# EAGLE design cdcio (EAGLE 6.6.0)
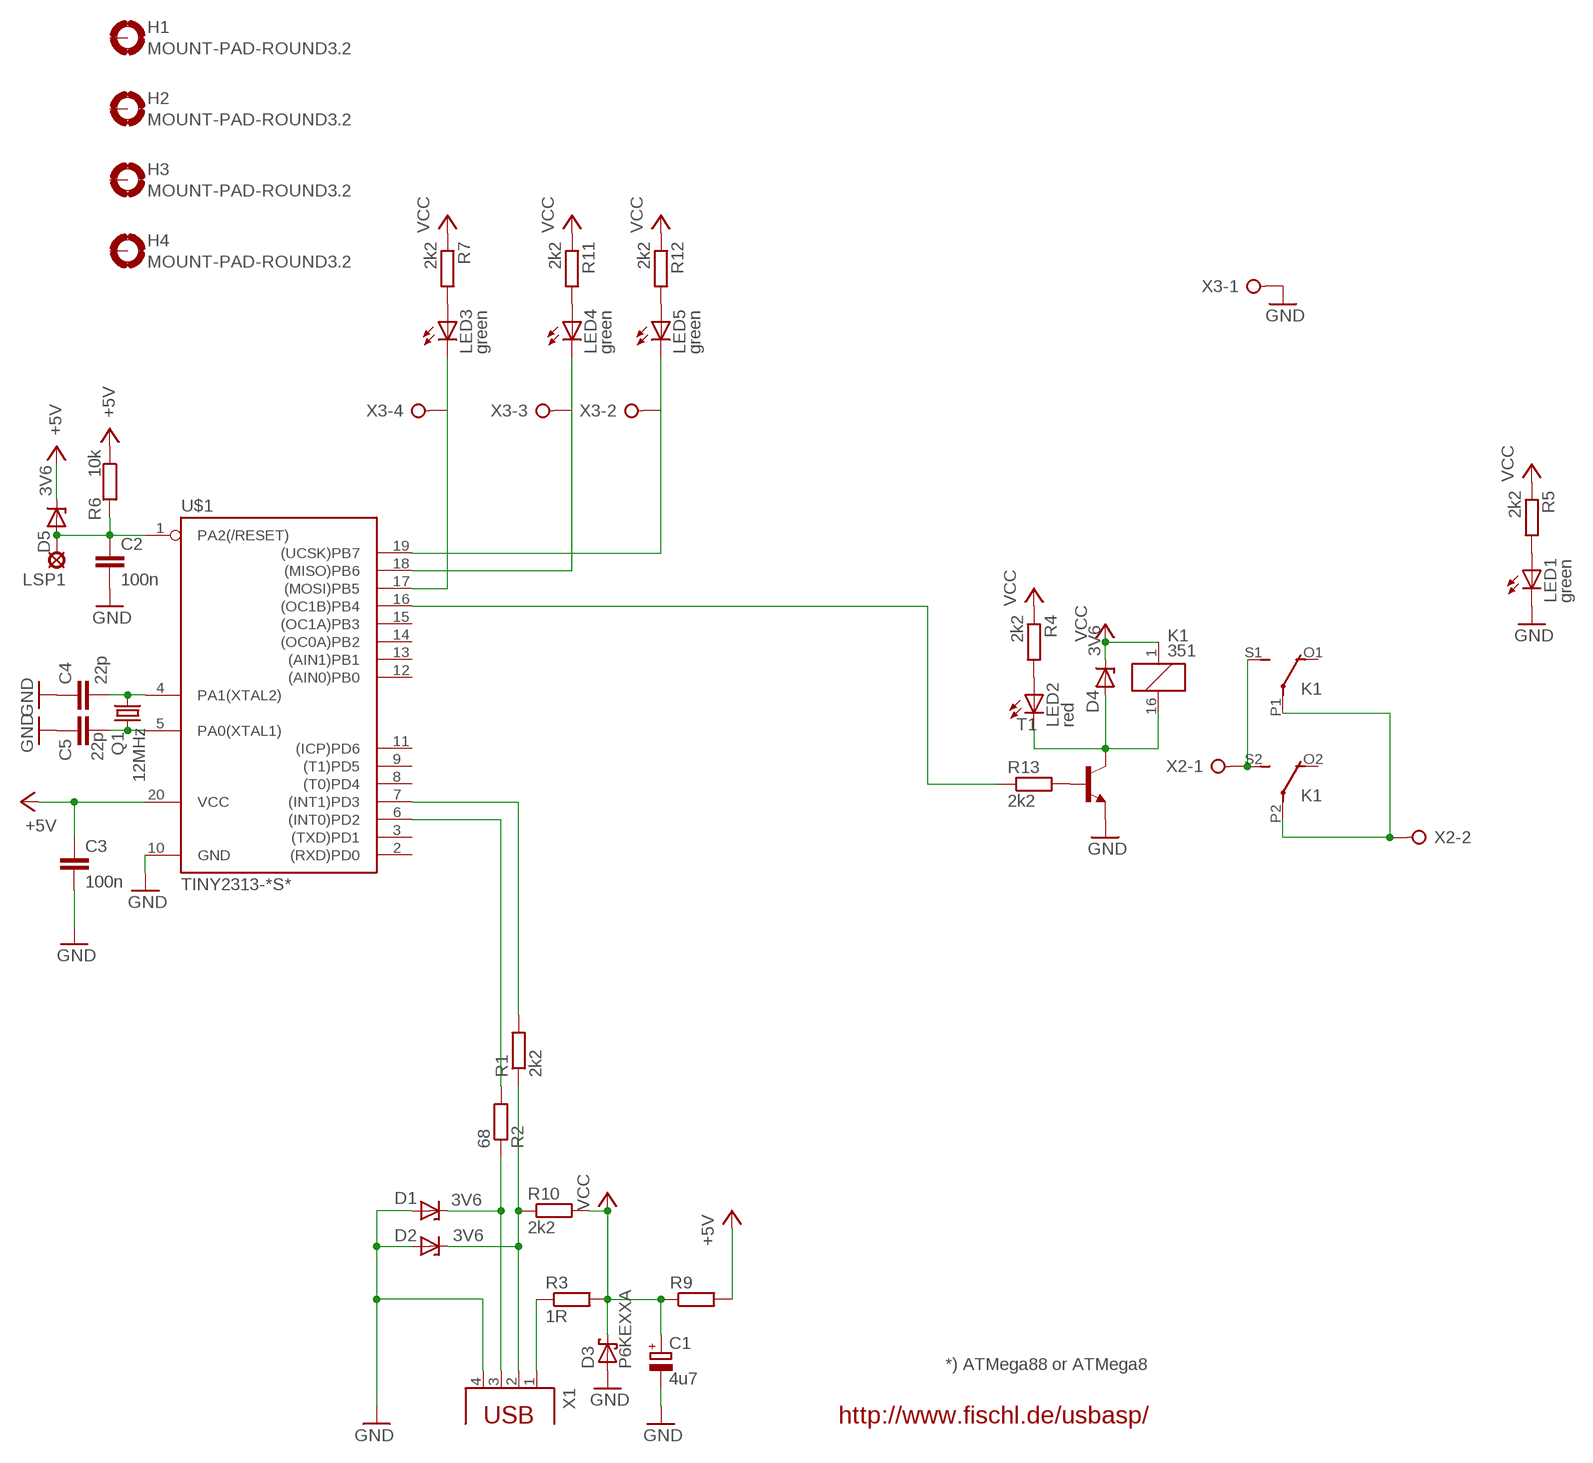
[diagram p0: schematic, sheet 1]

## Parts
C1  4u7  CPOL-EUE2.5-5  [E2,5-5]
C2  100n  C-EU025-024X044  [C025-024X044]
C3  100n  C-EU025-024X044  [C025-024X044]
C4  22p  C-EU025-024X044  [C025-024X044]
C5  22p  C-EU025-024X044  [C025-024X044]
D1  3V6  ZENER-DIODEDO34-7  [DO34Z7]
D2  3V6  ZENER-DIODEDO34-7  [DO34Z7]
D3  P6KEXXA  [C1702-15]
D4  3V6  ZENER-DIODEDO34-7  [DO34Z7]
D5  3V6  ZENER-DIODEDO34-7  [DO34Z7]
H1  MOUNT-PAD-ROUND3.2  [3,2-PAD]
H2  MOUNT-PAD-ROUND3.2  [3,2-PAD]
H3  MOUNT-PAD-ROUND3.2  [3,2-PAD]
H4  MOUNT-PAD-ROUND3.2  [3,2-PAD]
K1  351  [351]
LED1  green  LED3MM  [LED3MM]
LED2  red  LED3MM  [LED3MM]
LED3  green  LED3MM  [LED3MM]
LED4  green  LED3MM  [LED3MM]
LED5  green  LED3MM  [LED3MM]
LSP1  LSP10  [LSP10]
Q1  12MHz  CRYTALHC49S  [HC49/S]
R1  2k2  R-EU_0207/2V  [0207/2V]
R2  68  R-EU_0207/10  [0207/10]
R3  1R  R-EU_0207/2V  [0207/2V]
R4  2k2  R-EU_0207/2V  [0207/2V]
R5  2k2  R-EU_0207/2V  [0207/2V]
R6  10k  R-EU_0207/10  [0207/10]
R7  2k2  R-EU_0207/2V  [0207/2V]
R9  R-EU_0207/2V  [0207/2V]
R10  2k2  R-EU_0207/2V  [0207/2V]
R11  2k2  R-EU_0207/2V  [0207/2V]
R12  2k2  R-EU_0207/2V  [0207/2V]
R13  2k2  R-EU_0207/2V  [0207/2V]
T1  2N4124-NPN-TO92-CBE  [TO92-CBE]
U$1  TINY2313-*S*  [SO20L$]
X1  PN61729  [PN61729]
X2  W237-02P  [W237-132]
X3  W237-04P  [W237-4P]

## Nets
+5V: C3.1 D5.C R6.1 R9.2 U$1.20(VCC)
GND: C1.- C2.2 C3.2 C4.1 C5.1 D1.A D2.A D3.A LED1.K(C) T1.E U$1.10(GND) X1.4 X3.1
N$1: C2.1 D5.A LSP1.MP R6.2 U$1.1(PA2(/RESET))
N$2: R13.2 T1.B
N$3: R13.1 U$1.16((OC1B)PB4)
N$4: D4.A K1.16 LED2.K(C) T1.C
N$5: D2.C R1.1 R10.1 X1.2
N$6: K1.S1(2:S) K1.S2(3:S) X2.1
N$7: R2.2 U$1.6((INT0)PD2)
N$8: D1.C R2.1 X1.3
N$9: LED2.A R4.2
N$10: K1.P1(2:P) K1.P2(3:P) X2.2
N$11: R3.1 X1.1
N$12: LED1.A R5.2
N$13: LED3.A R7.2
N$14: LED4.A R11.2
N$15: LED5.A R12.2
N$16: R1.2 U$1.7((INT1)PD3)
N$17: LED3.K(C) U$1.17((MOSI)PB5) X3.4
N$18: LED4.K(C) U$1.18((MISO)PB6) X3.3
N$19: LED5.K(C) U$1.19((UCSK)PB7) X3.2
N$22: C4.2 Q1.2 U$1.4(PA1(XTAL2))
N$23: C5.2 Q1.1 U$1.5(PA0(XTAL1))
VCC: C1.+ D3.C D4.C K1.1 R3.2 R4.1 R5.1 R7.1 R9.1 R10.2 R11.1 R12.1
Unconnected: H1.B3,2(MOUNT) H2.B3,2(MOUNT) H3.B3,2(MOUNT) H4.B3,2(MOUNT) K1.O1(2:O) K1.O2(3:O) U$1.2((RXD)PD0) U$1.3((TXD)PD1) U$1.8((T0)PD4) U$1.9((T1)PD5) U$1.11((ICP)PD6) U$1.12((AIN0)PB0) U$1.13((AIN1)PB1) U$1.14((OC0A)PB2) U$1.15((OC1A)PB3)

## Notes on the sheet
- *) ATMega88 or ATMega8
- http://www.fischl.de/usbasp/

## Library data of the parts
C1 = rcl:CPOL-EU: POLARIZED CAPACITOR, European symbol
C2-C5 = rcl:C-EU: CAPACITOR, European symbol
D1 D2 D4 D5 = diode:ZENER-DIODE: Z-Diode
D3 = diode:P6KEXXA: DIODE transient-voltage suppressor
H1-H4 = holes:MOUNT-PAD-ROUND: MOUNTING PAD, round
K1 = relay:351: RELAY 2 x switch, Omron; OC_FARNELL: unknown; OC_NEWARK: unknown
LED1-LED5 = led:LED: LED OSRAM: - CHIPLED LG R971, LG N971, LY N971, LG Q971, LY Q971, LO R971, LY R971 LH N974, LH R974 LS Q976, LO Q976, LY Q976 LO Q996 - Hyper CHIPLED LW Q18S LB Q993, LB Q99A, LB R99A - SideLED LS A670, LO A670, LY A670, LG A670, LP A670 LB A673, LV A673, LT A673, LW A673 LH A674 LY A675 LS A676, LA A676, LO A676, LY A676, LW A676 LS A679, LY A679, LG A679 - Hyper Micro SIDELED® LS Y876, LA Y876, LO Y876, LY Y876 LT Y87S - SmartLED LW L88C, LW L88S LB L89C, LB L89S, LG L890 LS L89K, LO L89K, LY L89K LS L896, LA L896, LO L896, LY L896 - TOPLED LS T670, LO T670, LY T670, LG T670, LP T670 LSG T670, LSP T670, LSY T670, LOP T670, LYG T670 LG T671, LOG T671, LSG T671 LB T673, LV T673, LT T673, LW T673 LH T674 LS T676, LA T676, LO T676, LY T676, LB T676, LH T676, LSB T676, LW T676 LB T67C, LV T67C, LT T67C, LS T67K, LO T67K, LY T67K, LW E67C LS E67B, LA E67B, LO E67B, LY E67B, LB E67C, LV E67C, LT E67C LW T67C LS T679, LY T679, LG T679 LS T770, LO T770, LY T770, LG T770, LP T770 LB T773, LV T773, LT T773, LW T773 LH T774 LS E675, LA E675, LY E675, LS T675 LS T776, LA T776, LO T776, LY T776, LB T776 LHGB T686 LT T68C, LB T68C - Hyper Mini TOPLED® LB M676 - Mini TOPLED Santana® LG M470 LS M47K, LO M47K, LY M47K Source: http://www.osram.convergy.de/
LSP1 = solpad:LSP10: SOLDER PAD drill 1.0 mm, distributor Buerklin, 12H555
Q1 = crystal:CRYTAL: CRYSTAL
R1-R7 R9-R13 = rcl:R-EU_: RESISTOR, European symbol
T1 = transistor:*-NPN-: NPN Transistror BF959 corrected 2008.03.06
U$1 = avr-7:TINY2313*: Atmel Tiny2313 2K Flash, 128 bytes EEPROM, 128 bytes RAM
X1 = con-berg:PN61729: BERG USB connector
X2 = con-wago-508:W237-02P: WAGO SREW CLAMP; OC_FARNELL: unknown; OC_NEWARK: unknown
X3 = con-wago-508:W237-04P: WAGO SREW CLAMP; OC_FARNELL: unknown; OC_NEWARK: unknown

## Board
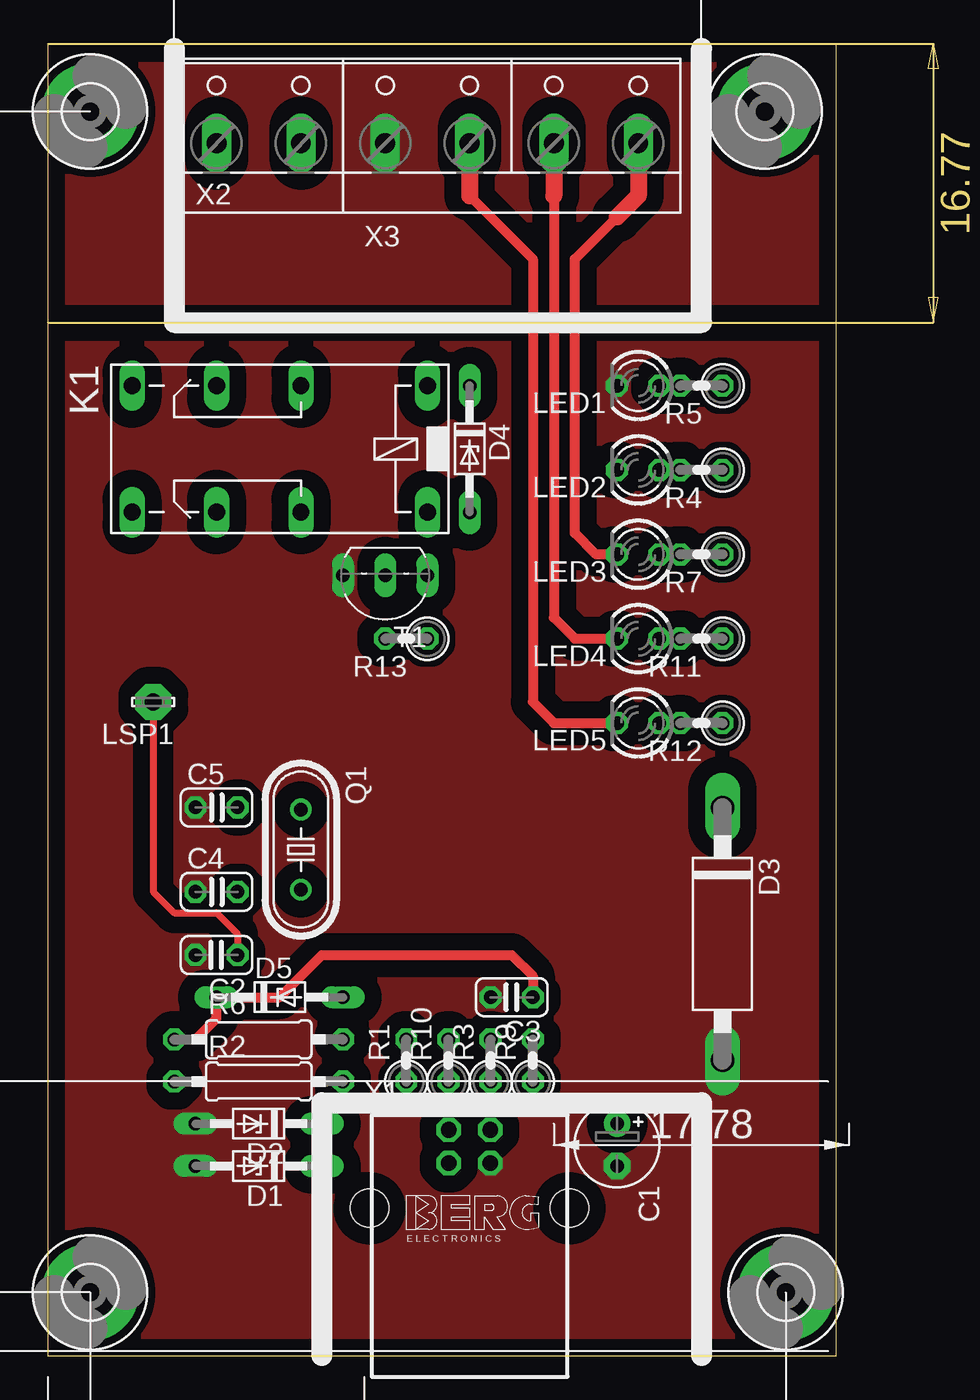
[diagram p1: board, top side]
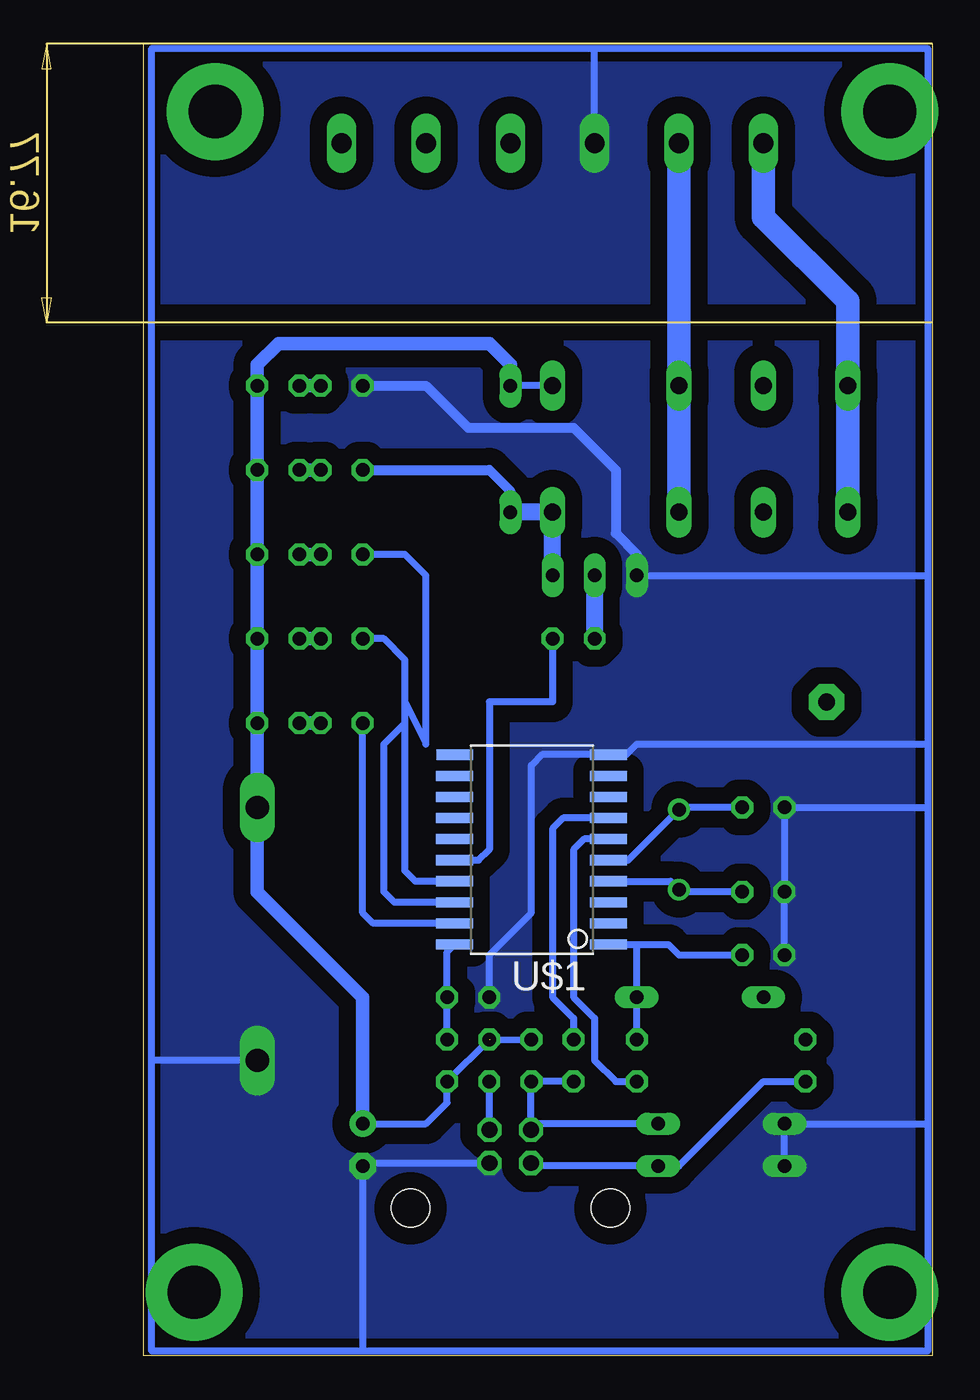
[diagram p2: board, bottom side, seen from below]

Size 47.5 x 79 mm. Coordinates in mm from the lower left corner, seen from the top.
Outline: 0,0 47.5,0 47.5,79 0,79 0,0
Copper layers (1*16): Top 0.035mm / dielectric 1.5mm / Bottom 0.035mm
Design rules "default": minimum track width 10mil, minimum drill 24mil, track to track 8mil, track to pad 8mil, pad to pad 8mil, via to via 8mil, smd to smd 8mil, copper to edge 40mil, drill to drill 8mil, minimum pad ring 10mil, minimum via ring 8mil, stop-mask expansion 4mil, vias tented up to drill 0mil, thermal gap 10mil

### Footprints (pad centres in the part's own frame; a part is rotated, then mirrored left to right if it is on the bottom)
E2,5-5 = drill 0.813 pad 1.6: + -1.27,0 | drill 0.813 pad 1.6 octagon: - 1.27,0
C025-024X044 = drill 0.813 octagon: 1 -1.27,0; 2 1.27,0
DO34Z7 = drill 0.813 long: A 3.81,0; C -3.81,0
C1702-15 = drill 1.397 long: A 7.62,0; C -7.62,0
3,2-PAD = drill 3.2 pad 5.842: B3,2 0,0
351 = drill 1.016 long: 1 -3.81,-3.81; 16 -3.81,3.81; O1 8.89,-3.81; O2 8.89,3.81; P1 3.81,-3.81; P2 3.81,3.81; S1 13.97,-3.81; S2 13.97,3.81
LED3MM = drill 0.813 octagon: A -1.27,0; K 1.27,0
LSP10 = drill 1.016 pad 2.159 octagon: MP 0,0
HC49/S = drill 0.813: 1 -2.413,0; 2 2.413,0
0207/2V = drill 0.813 octagon: 1 -1.27,0; 2 1.27,0
0207/10 = drill 0.813 octagon: 1 -5.08,0; 2 5.08,0
TO92-CBE = drill 0.813 long: B 0,0; C -2.54,0; E 2.54,0
SO20L$ = smd 0.61 x 2.21: 1 -5.715,-4.636; 2 -4.445,-4.636; 3 -3.175,-4.636; 4 -1.905,-4.636; 5 -0.635,-4.636; 6 0.635,-4.636; 7 1.905,-4.636; 8 3.175,-4.636; 9 4.445,-4.636; 10 5.715,-4.636; 11 5.715,4.61; 12 4.445,4.636; 13 3.175,4.636; 14 1.905,4.636; 15 0.635,4.636; 16 -0.635,4.636; 17 -1.905,4.636; 18 -3.175,4.636; 19 -4.445,4.636; 20 -5.715,4.636
PN61729 = drill 0.95 octagon: 1 1.25,4.71; 2 -1.25,4.71; 3 -1.25,2.71; 4 1.25,2.71 | hole 2.3: -6.02,0; 6.02,0
W237-132 = drill 1.194 long: 1 -2.54,-0.635; 2 2.54,-0.635
W237-4P = drill 1.194 long: 1 -7.62,-0.635; 2 -2.54,-0.635; 3 2.54,-0.635; 4 7.62,-0.635

### Placement (x,y rotation side)
C1  34.29,12.7 270 top
C2  10.16,24.13 180 top
C3  27.94,21.59 180 top
C4  10.16,27.94 0 top
C5  10.16,33.02 0 top
D1  12.7,11.43 180 top
D2  12.7,13.97 180 top
D3  40.64,25.4 270 top
D4  25.4,54.61 270 top
D5  13.97,21.59 0 top
H1  2.54,3.81 0 top
H2  44.45,3.81 0 top
H3  2.54,74.93 0 top
H4  43.18,74.93 0 top
K1  19.05,54.61 180 top
LED1  35.56,58.42 180 top
LED2  35.56,53.34 180 top
LED3  35.56,48.26 180 top
LED4  35.56,43.18 180 top
LED5  35.56,38.1 180 top
LSP1  6.35,39.37 180 top
Q1  15.24,30.48 270 top
R1  21.59,17.78 90 top
R2  12.7,16.51 0 top
R3  26.67,17.78 90 top
R4  39.37,53.34 180 top
R5  39.37,58.42 180 top
R6  12.7,19.05 0 top
R7  39.37,48.26 180 top
R9  29.21,17.78 90 top
R10  24.13,17.78 90 top
R11  39.37,43.18 180 top
R12  39.37,38.1 180 top
R13  21.59,43.18 180 top
T1  20.32,46.99 180 top
U$1  24.13,30.48 90 bottom
X1  25.4,8.89 0 top
X2  12.7,73.66 0 top
X3  27.94,73.66 0 top

### Tracks (layer width: path | path; a pad name or v marks a point on that pad's centre or on a via)
+5V
  Top 0.61: R6.1 8.89,19.05 10.16,20.32 D5.C 13.97,21.59 16.51,24.13 27.94,24.13 29.21,22.86 C3.1
  Bottom 0.406: U$1.20 29.21,24.32 C3.1 R9.2
GND
  Bottom 0.406: C3.2 26.67,24.13 24.13,26.67 24.13,35.56 23.5,36.2 U$1.10 18.41,36.2 17.78,36.83 0.27,36.83 | X1.4 34.12,11.6 C1.- 34.29,0.27 | 34.29,0.27 46.99,0.27 46.99,17.78 | 46.99,17.78 46.99,78.74 20.32,78.74 | 20.32,78.74 0.27,78.74 0.27,46.99 | 0.27,46.99 0.27,36.83 | 0.27,36.83 0.27,33.02 | 0.27,33.02 0.27,13.97 | 0.27,13.97 0.27,0.27 34.29,0.27 | 0.27,13.97 D2.A D1.A | T1.E 0.27,46.99 | 0.27,33.02 C5.1 C4.1 C2.2 | D3.A 46.99,17.78 | X3.1 20.32,78.74
  Bottom 0.61: LED1.K 30.48,58.42 27.94,55.88 21.59,55.88 19.05,53.34 19.05,49.53 17.78,48.26 T1.E
  pour Bottom (isolate 1.016, no thermals): 0,81.28 46.99,81.28 48.26,-1.27 0,0
  pour Top (isolate 1.016, no thermals): 0,80.01 49.53,80.01 49.53,-1.27 0,-1.27
N$1
  Top 0.406: LSP1.MP 6.35,27.94 7.62,26.67 10.16,26.67 11.43,25.4 C2.1
  Bottom 0.406: U$1.1 17.78,24.77 | 17.78,24.77 15.88,24.77 15.24,24.13 C2.1 | R6.2 D5.A 17.78,24.77
N$2
  Bottom 1.016: T1.B R13.2
N$3
  Bottom 0.406: R13.1 22.86,39.37 26.67,39.37 26.67,30.48 27.3,29.84 U$1.16
N$4
  Bottom 0.61: LED2.K 26.67,53.34 25.4,52.07 D4.A
  Bottom 1.016: T1.C K1.16 D4.A
N$5
  Bottom 0.406: D2.C 23.78,13.97 X1.2 24.15,16.49 R10.1 R1.1
N$6
  Bottom 1.422: K1.S2 K1.S1 5.08,63.5 10.16,68.58 X2.1
N$7
  Bottom 0.406: U$1.6 20.95,31.11 21.59,30.48 21.59,21.59 20.32,20.32 20.32,17.78 19.05,16.51 R2.2
N$8
  Bottom 0.406: X1.3 23.98,11.43 D1.C 15.24,11.43 10.16,16.51 R2.1
N$9
  Bottom 0.813: LED2.A R4.2
N$10
  Bottom 1.422: X2.2 K1.P1 K1.P2
N$11
  Bottom 0.406: X1.1 26.65,16.49 R3.1
N$12
  Bottom 0.813: LED1.A R5.2
N$13
  Bottom 0.813: R7.2 LED3.A
N$14
  Bottom 0.813: LED4.A R11.2
N$15
  Bottom 0.813: R12.2 LED5.A
N$16
  Bottom 0.406: U$1.7 22.23,32.38 22.86,31.75 22.86,21.59 21.59,20.32 R1.2
N$17
  Top 0.61: LED3.K 33.02,48.26 31.75,49.53 31.75,66.04 34.29,68.58
  Top 1.016: X3.4 35.56,69.85 34.29,68.58
  Bottom 0.406: U$1.17 31.11,28.57 31.75,29.21 31.75,39.37 30.48,36.83 30.48,46.99 31.75,48.26 LED3.K
N$18
  Top 0.61: 30.48,69.85 30.48,44.45 31.75,43.18 LED4.K
  Top 1.016: X3.3 30.48,69.85
  Bottom 0.406: U$1.18 32.38,27.3 33.02,27.94 33.02,36.83 31.75,38.1 31.75,41.91 33.02,43.18 LED4.K
N$19
  Top 0.61: 25.4,69.85 29.21,66.04 29.21,39.37 30.48,38.1 LED5.K
  Top 1.016: X3.2 25.4,69.85
  Bottom 0.406: U$1.19 33.66,26.04 34.29,26.67 LED5.K
N$22
  Bottom 0.406: U$1.4 15.75,28.57 Q1.2 15.11,27.94 C4.2
N$23
  Bottom 0.406: C5.2 15.11,33.02 Q1.1 18.29,29.84 U$1.5
VCC  (1 unrouted)
  Bottom 0.406: 33.92,13.6 C1.+ 30.48,13.97 29.21,15.24 R9.1 R3.2 | 26.65,19.03 R10.2 | K1.1 D4.C
  Bottom 0.813: D4.C 25.4,59.69 26.67,60.96 39.37,60.96 40.64,59.69 R5.1 R4.1 R7.1 R11.1 R12.1 D3.C 40.64,27.94 34.29,21.59 C1.+